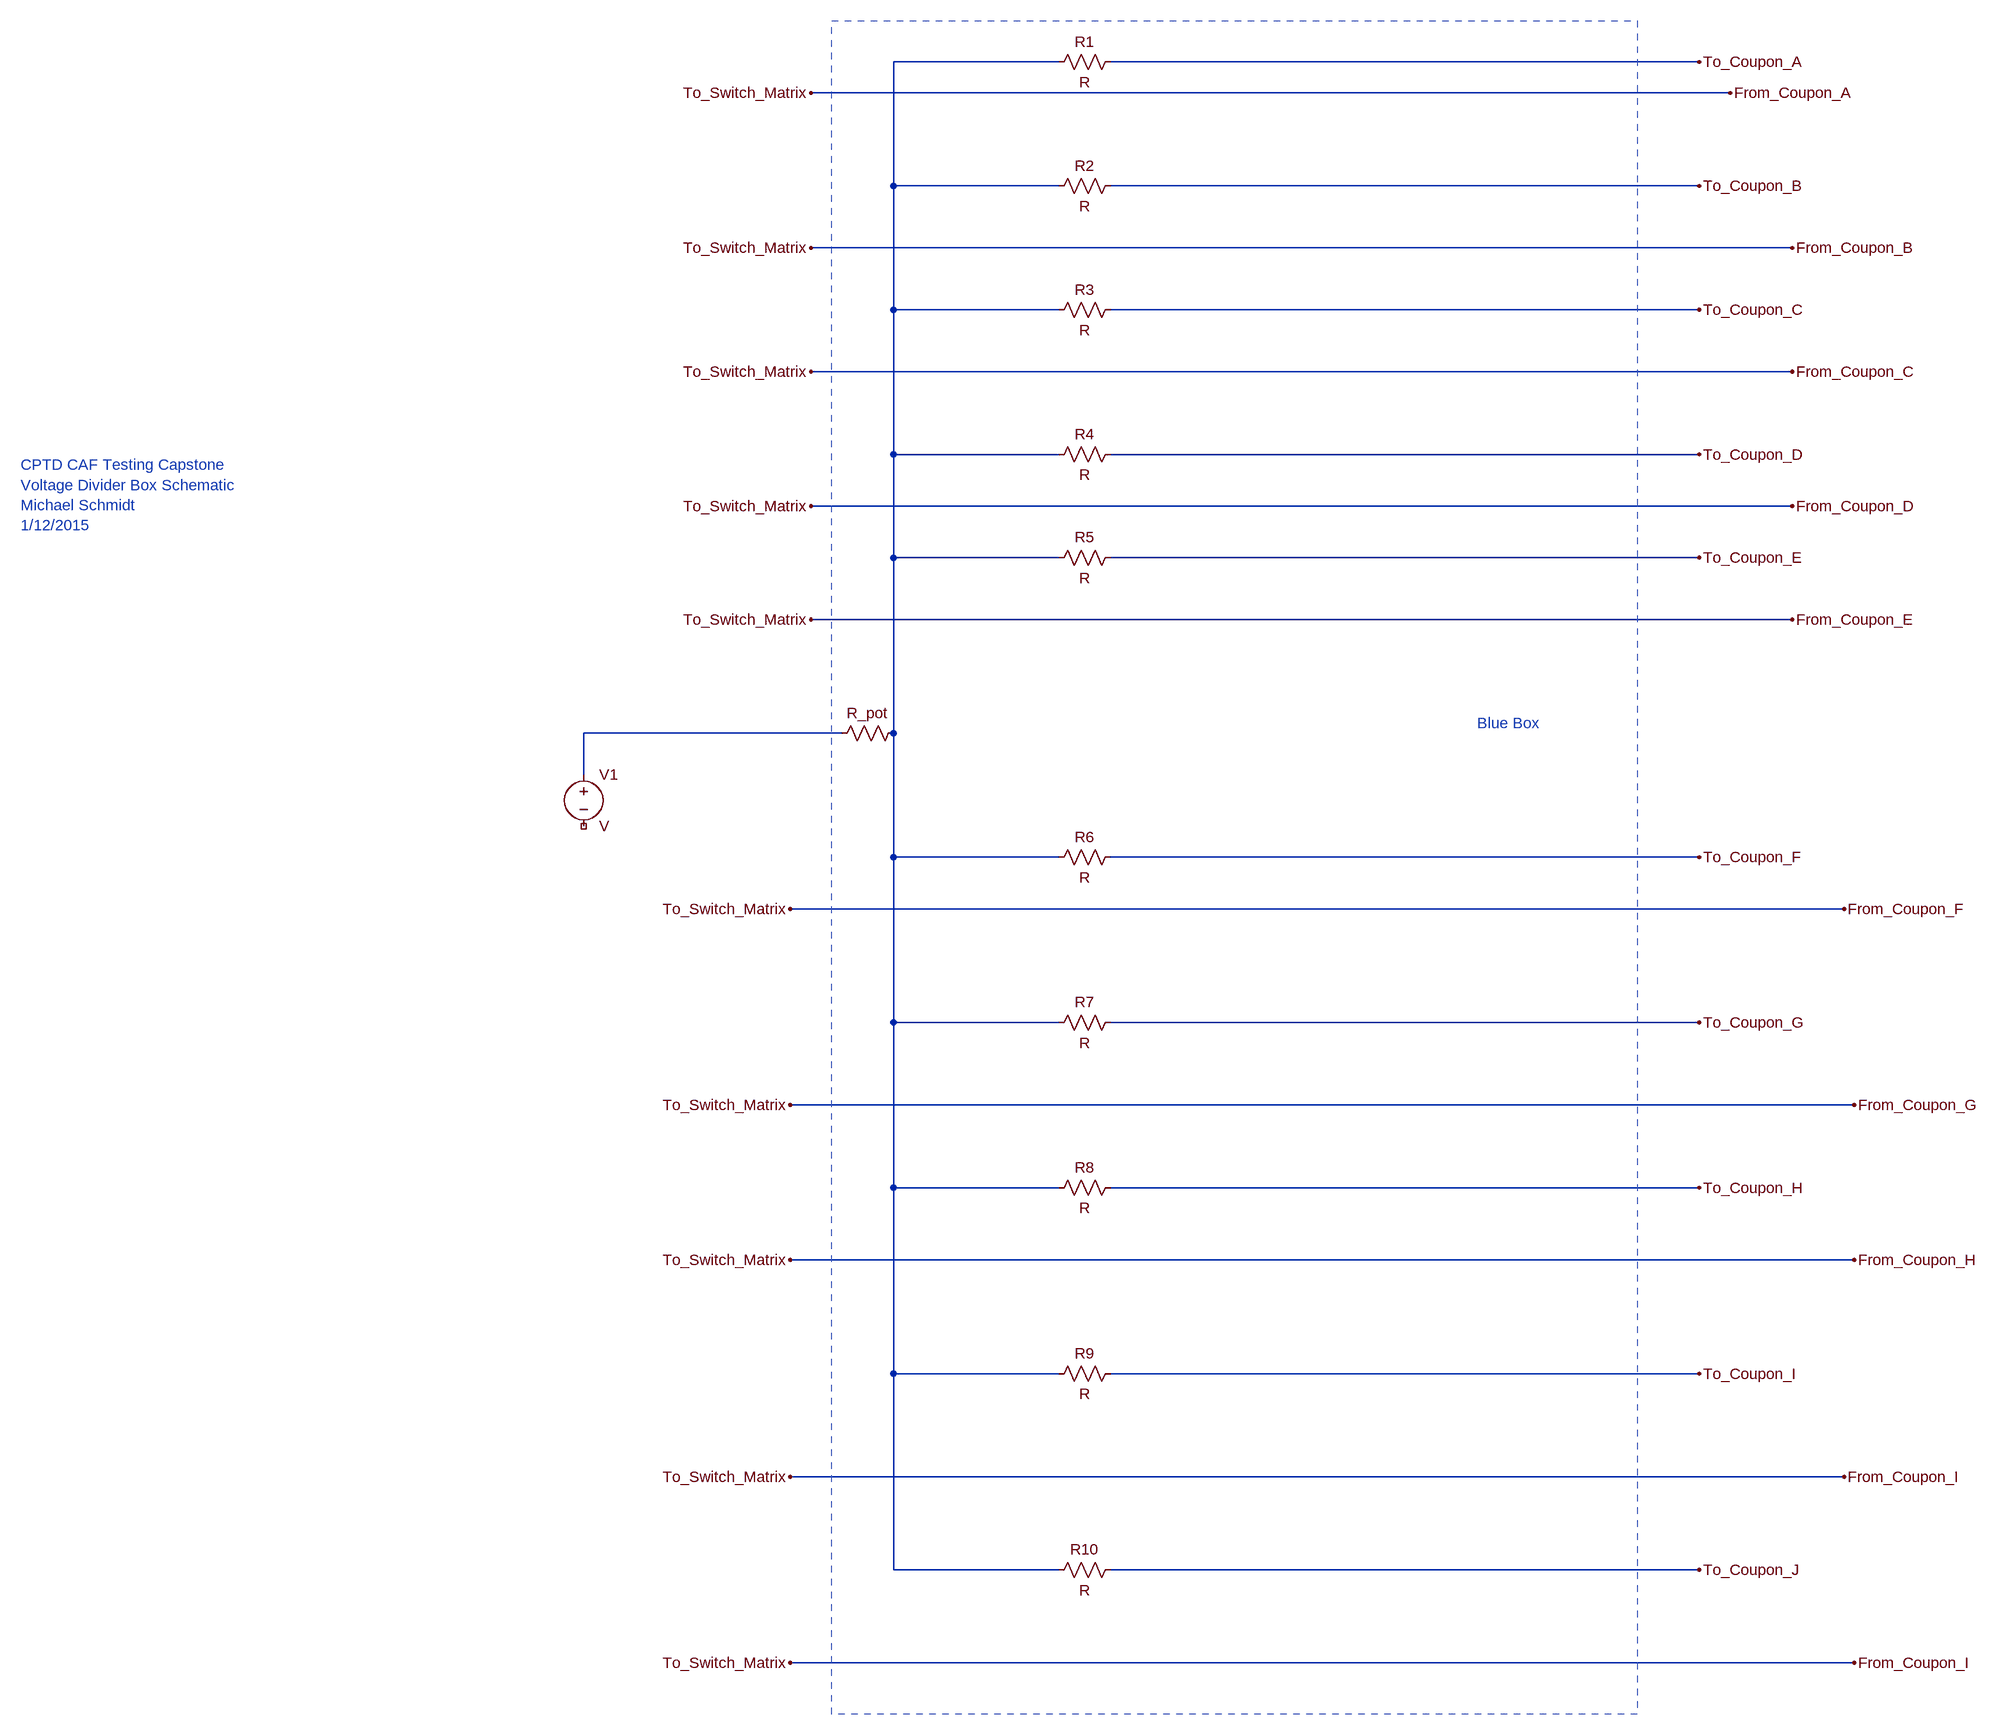
[diagram p0: schematic Blue_Box_Schematic.asc]
Blue_Box_Schematic.asc, the LTspice schematic file:
Version 4
SHEET 1 1064 988
WIRE -1504 -1824 -1760 -1824
WIRE -512 -1824 -1424 -1824
WIRE -464 -1776 -1888 -1776
WIRE -1760 -1632 -1760 -1824
WIRE -1504 -1632 -1760 -1632
WIRE -512 -1632 -1424 -1632
WIRE -368 -1536 -1888 -1536
WIRE -1760 -1440 -1760 -1632
WIRE -1504 -1440 -1760 -1440
WIRE -512 -1440 -1424 -1440
WIRE -368 -1344 -1888 -1344
WIRE -1760 -1216 -1760 -1440
WIRE -1504 -1216 -1760 -1216
WIRE -512 -1216 -1424 -1216
WIRE -368 -1136 -1888 -1136
WIRE -1760 -1056 -1760 -1216
WIRE -1504 -1056 -1760 -1056
WIRE -512 -1056 -1424 -1056
WIRE -368 -960 -1888 -960
WIRE -1840 -784 -2240 -784
WIRE -1760 -784 -1760 -1056
WIRE -2240 -720 -2240 -784
WIRE -1760 -592 -1760 -784
WIRE -1504 -592 -1760 -592
WIRE -512 -592 -1424 -592
WIRE -288 -512 -1920 -512
WIRE -1760 -336 -1760 -592
WIRE -1504 -336 -1760 -336
WIRE -512 -336 -1424 -336
WIRE -272 -208 -1920 -208
WIRE -1760 -80 -1760 -336
WIRE -1504 -80 -1760 -80
WIRE -512 -80 -1424 -80
WIRE -272 32 -1920 32
WIRE -1760 208 -1760 -80
WIRE -1504 208 -1760 208
WIRE -512 208 -1424 208
WIRE -288 368 -1920 368
WIRE -1760 512 -1760 208
WIRE -1504 512 -1760 512
WIRE -512 512 -1424 512
WIRE -272 656 -1920 656
FLAG -512 -1824 To_Coupon_A
FLAG -512 -1632 To_Coupon_B
FLAG -512 -1440 To_Coupon_C
FLAG -512 -1056 To_Coupon_E
FLAG -512 -592 To_Coupon_F
FLAG -512 -336 To_Coupon_G
FLAG -512 -80 To_Coupon_H
FLAG -512 208 To_Coupon_I
FLAG -512 512 To_Coupon_J
FLAG -512 -1216 To_Coupon_D
FLAG -464 -1776 From_Coupon_A
FLAG -1888 -1776 To_Switch_Matrix
FLAG -368 -1536 From_Coupon_B
FLAG -368 -1344 From_Coupon_C
FLAG -368 -1136 From_Coupon_D
FLAG -368 -960 From_Coupon_E
FLAG -1888 -1536 To_Switch_Matrix
FLAG -1888 -1344 To_Switch_Matrix
FLAG -1888 -1136 To_Switch_Matrix
FLAG -1888 -960 To_Switch_Matrix
FLAG -288 -512 From_Coupon_F
FLAG -272 -208 From_Coupon_G
FLAG -272 32 From_Coupon_H
FLAG -288 368 From_Coupon_I
FLAG -272 656 From_Coupon_I
FLAG -1920 -512 To_Switch_Matrix
FLAG -1920 -208 To_Switch_Matrix
FLAG -1920 32 To_Switch_Matrix
FLAG -1920 368 To_Switch_Matrix
FLAG -1920 656 To_Switch_Matrix
SYMBOL voltage -2240 -736 R0
SYMATTR InstName V1
SYMBOL res -1520 -1808 R270
WINDOW 0 32 56 VTop 2
WINDOW 3 0 56 VBottom 2
SYMATTR InstName R1
SYMBOL res -1520 -1616 R270
WINDOW 0 32 56 VTop 2
WINDOW 3 0 56 VBottom 2
SYMATTR InstName R2
SYMBOL res -1520 -1424 R270
WINDOW 0 32 56 VTop 2
WINDOW 3 0 56 VBottom 2
SYMATTR InstName R3
SYMBOL res -1520 -1200 R270
WINDOW 0 32 56 VTop 2
WINDOW 3 0 56 VBottom 2
SYMATTR InstName R4
SYMBOL res -1520 -1040 R270
WINDOW 0 32 56 VTop 2
WINDOW 3 0 56 VBottom 2
SYMATTR InstName R5
SYMBOL res -1520 -576 R270
WINDOW 0 32 56 VTop 2
WINDOW 3 0 56 VBottom 2
SYMATTR InstName R6
SYMBOL res -1520 -320 R270
WINDOW 0 32 56 VTop 2
WINDOW 3 0 56 VBottom 2
SYMATTR InstName R7
SYMBOL res -1520 -64 R270
WINDOW 0 32 56 VTop 2
WINDOW 3 0 56 VBottom 2
SYMATTR InstName R8
SYMBOL res -1520 224 R270
WINDOW 0 32 56 VTop 2
WINDOW 3 0 56 VBottom 2
SYMATTR InstName R9
SYMBOL res -1520 528 R270
WINDOW 0 32 56 VTop 2
WINDOW 3 0 56 VBottom 2
SYMATTR InstName R10
SYMBOL res -1856 -768 R270
WINDOW 0 32 56 VTop 2
WINDOW 3 4 56 VTop 2
SYMATTR InstName R_pot
SYMATTR Value ""
TEXT -3112 -1200 Left 2 ;CPTD CAF Testing Capstone\nVoltage Divider Box Schematic\nMichael Schmidt\n1/12/2015
TEXT -856 -800 Left 2 ;Blue Box
RECTANGLE Normal -608 736 -1856 -1888 1

The netlist it stands for:
* Blue_Box_Schematic.asc
V1 N002 NC_01 V
R1 N001 To_Coupon_A R
R2 N001 To_Coupon_B R
R3 N001 To_Coupon_C R
R4 N001 To_Coupon_D R
R5 N001 To_Coupon_E R
R6 N001 To_Coupon_F R
R7 N001 To_Coupon_G R
R8 N001 To_Coupon_H R
R9 N001 To_Coupon_I R
R10 N001 To_Coupon_J R
R_pot N002 N001
* CPTD CAF Testing Capstone
* Voltage Divider Box Schematic
* Michael Schmidt
* 1/12/2015
* Blue Box
.backanno
.end